# EAGLE schematic module (EAGLE 9.6.2)

## Sheet 1 of 5
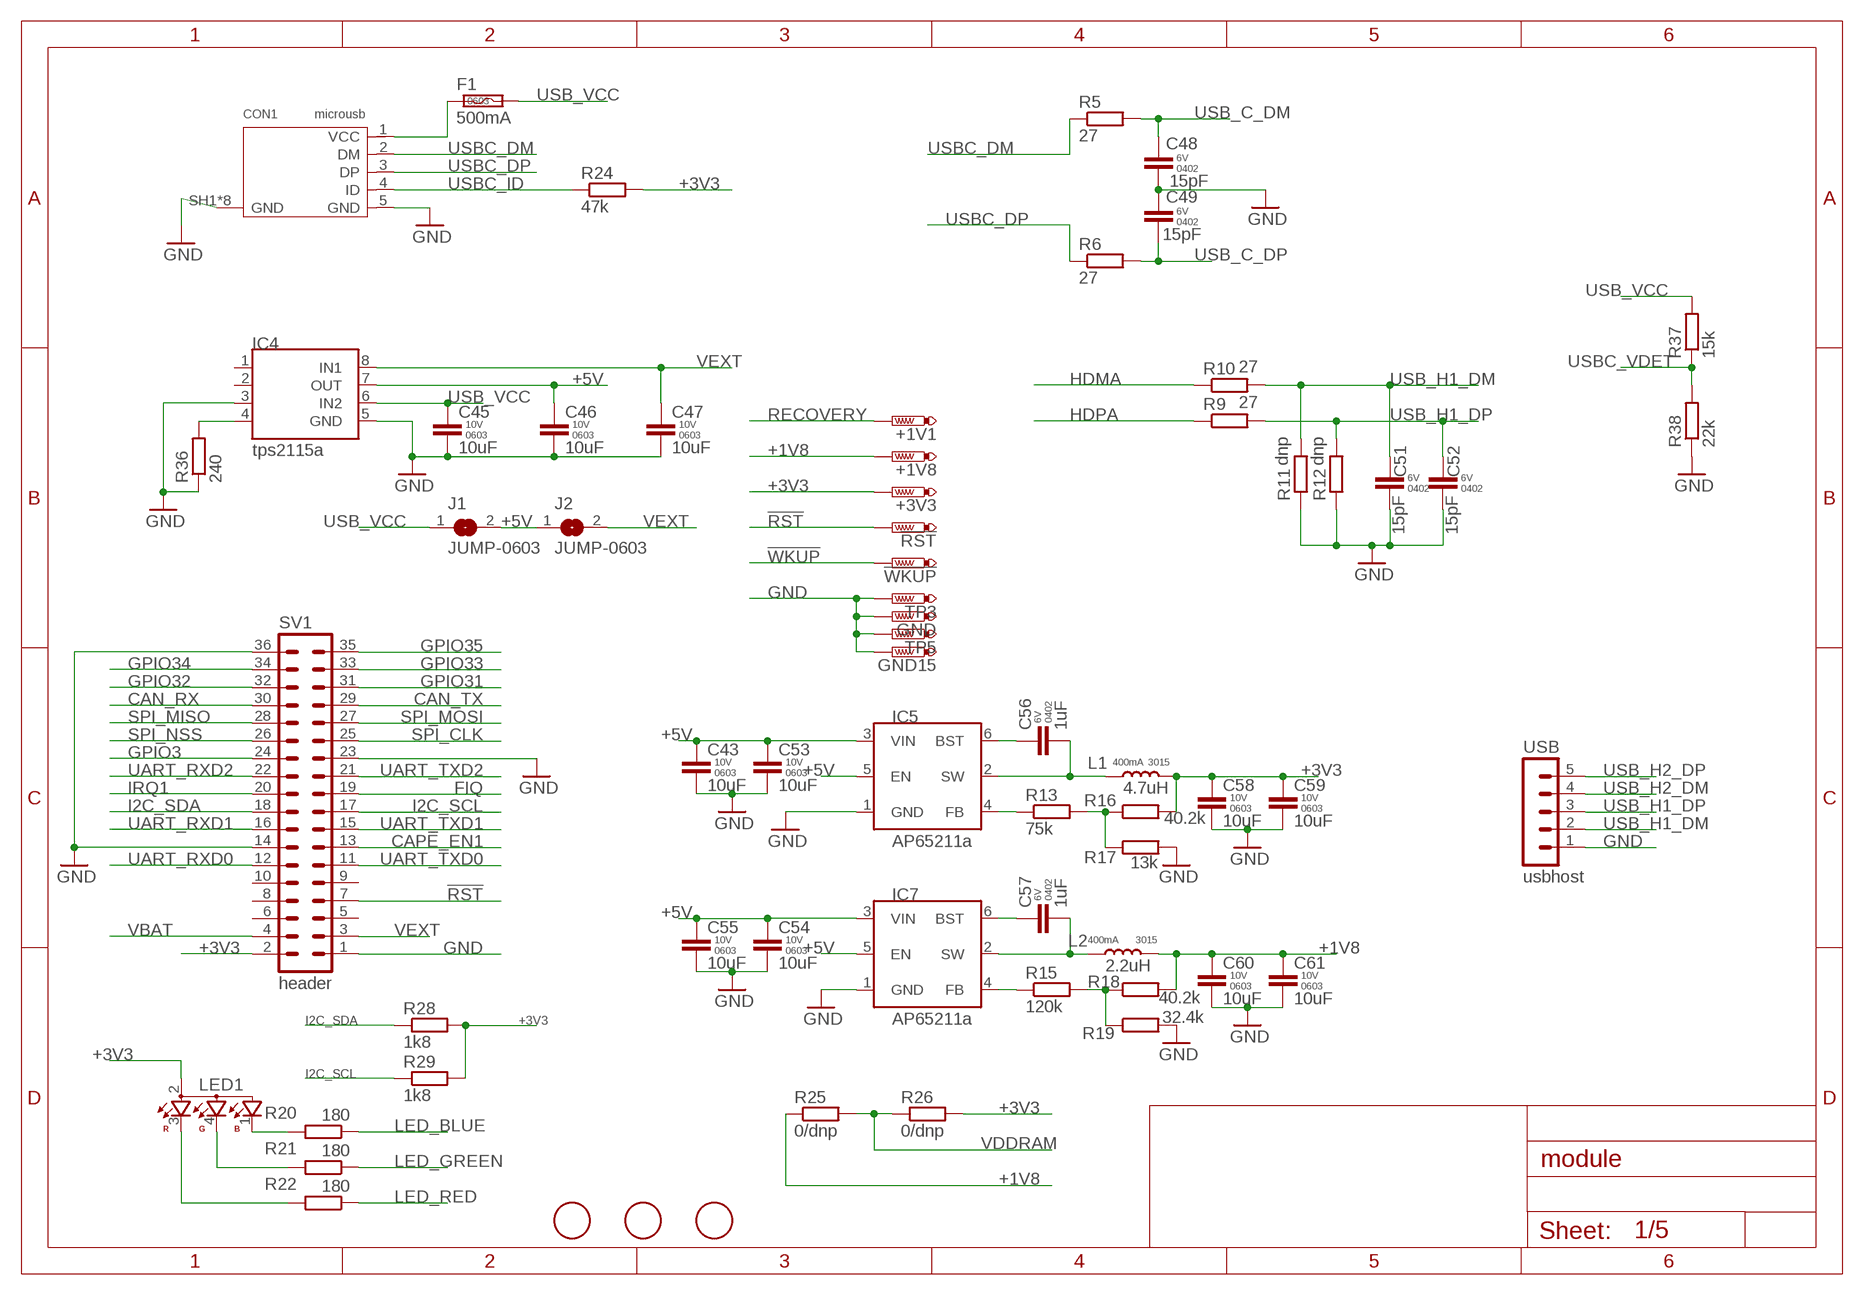
[diagram p0: schematic, sheet 1]

### Parts
!RST  PTR1B1,27  [B1,27]
!WKUP  PTR1B1,27  [B1,27]
+1V1  PTR1B1,27  [B1,27]
+1V8  PTR1B1,27  [B1,27]
+3V3  PTR1B1,27  [B1,27]
C43  10uF  CAP-0603  [C0603]
C45  10uF  CAP-0603  [C0603]
C46  10uF  CAP-0603  [C0603]
C47  10uF  CAP-0603  [C0603]
C48  15pF  CAP-0402  [C0402K]
C49  15pF  CAP-0402  [C0402K]
C51  15pF  CAP-0402  [C0402K]
C52  15pF  CAP-0402  [C0402K]
C53  10uF  CAP-0603  [C0603]
C54  10uF  CAP-0603  [C0603]
C55  10uF  CAP-0603  [C0603]
C56  1uF  CAP-0402  [C0402K]
C57  1uF  CAP-0402  [C0402K]
C58  10uF  CAP-0603  [C0603]
C59  10uF  CAP-0603  [C0603]
C60  10uF  CAP-0603  [C0603]
C61  10uF  CAP-0603  [C0603]
CON1  microusb  10118194-0001LF  [10118194]
F1  500mA  FUSE-PTC-0603  [F0603]
GND  PTR1B1,27  [B1,27]
GND15  PTR1B1,27  [B1,27]
IC4  tps2115a  TPS2115A  [TSSOP8]
IC5  AP65211  [SOT95P280X110-6]
IC7  AP65211  [SOT95P280X110-6]
J1  JUMP-0603  [C0603]
J2  JUMP-0603  [C0603]
L1  4.7uH  DJNR3015  [L3230M]
L2  2.2uH  DJNR3015  [L3230M]
LED1  OSTB1204C1E  [321015RGB]
R5  27  R-EU_R0402  [R0402]
R6  27  R-EU_R0402  [R0402]
R9  27  R-EU_R0402  [R0402]
R10  27  R-EU_R0402  [R0402]
R11  dnp  R-EU_R0402  [R0402]
R12  dnp  R-EU_R0402  [R0402]
R13  75k  R-EU_R0402  [R0402]
R15  120k  R-EU_R0402  [R0402]
R16  40.2k  R-EU_R0402  [R0402]
R17  13k  R-EU_R0402  [R0402]
R18  40.2k  R-EU_R0402  [R0402]
R19  32.4k  R-EU_R0402  [R0402]
R20  180  R-EU_R0402  [R0402]
R21  180  R-EU_R0402  [R0402]
R22  180  R-EU_R0402  [R0402]
R24  47k  R-EU_R0402  [R0402]
R25  0/dnp  R-EU_R0603  [R0603]
R26  0/dnp  R-EU_R0603  [R0603]
R28  1k8  R-EU_R0402  [R0402]
R29  1k8  R-EU_R0402  [R0402]
R36  240  R-EU_R0402  [R0402]
R37  15k  R-EU_R0402  [R0402]
R38  22k  R-EU_R0402  [R0402]
SV1  header  MA18-2  [MA18-2]
TP3  PTR1B1,27  [B1,27]
TP5  PTR1B1,27  [B1,27]
U$1  FIDUCIAL  [FIDUCIAL_1MM]
U$2  FIDUCIAL  [FIDUCIAL_1MM]
U$3  FIDUCIAL  [FIDUCIAL_1MM]
USB  usbhost  MA05-1  [MA05-1]

### Nets
!RST: !RST.TP SV1.7 ; also sheet 2
!WKUP: !WKUP.TP ; also sheet 2
+1V8: +1V8.TP C60.1 C61.1 L2.2 R18.2 R25.1 ; also sheet 2
+3V3: +3V3.TP C58.1 C59.1 L1.2 LED1.2 R16.2 R24.2 R26.2 R28.2 R29.2 SV1.2 ; also sheet 2,5
+5V: C43.1 C46.1 C53.1 C54.1 C55.1 IC4.7(OUT) IC5.3(VIN) IC5.5(EN) IC7.3(VIN) IC7.5(EN) J1.2 J2.1
CAN_RX: SV1.30
CAN_TX: SV1.29
CAPE_EN1: SV1.13 ; also sheet 2
FIQ: SV1.19 ; also sheet 2
GND: C43.2 C45.2 C46.2 C47.2 C48.2 C49.2 C51.2 C52.2 C53.2 C54.2 C55.2 C58.2 C59.2 C60.2 C61.2 CON1.5(GND) CON1.SH1(GND) CON1.SH2(GND) CON1.SH3(GND) CON1.SH4(GND) CON1.SH5(GND) CON1.SH6(GND) CON1.SH7(GND) CON1.SH8(GND) GND15.TP GND.TP IC4.3 IC4.5(GND) IC5.1(GND) IC7.1(GND) R11.1 R12.1 R17.2 R19.2 R36.1 R38.1 SV1.1 SV1.14 SV1.23 SV1.36 TP3.TP TP5.TP USB.1 ; also sheet 2,3,4,5
GPIO3: SV1.24 ; also sheet 2
GPIO31: SV1.31 ; also sheet 2
GPIO32: SV1.32 ; also sheet 2
GPIO33: SV1.33 ; also sheet 2
GPIO34: SV1.34 ; also sheet 2
GPIO35: SV1.35 ; also sheet 2
HDMA: R10.1 ; also sheet 2
HDPA: R9.1 ; also sheet 2
I2C_SCL: R29.1 SV1.17 ; also sheet 2
I2C_SDA: R28.1 SV1.18 ; also sheet 2
IRQ1: SV1.20 ; also sheet 2
LED_BLUE: R20.1 ; also sheet 2
LED_GREEN: R21.1 ; also sheet 2
LED_RED: R22.1 ; also sheet 2
N$3: C56.2 IC5.2(SW) L1.1
N$4: CON1.1(VCC) F1.1
N$6: IC4.4 R36.2
N$8: C57.2 IC7.2(SW) L2.1
N$9: LED1.1 R20.2
N$10: C56.1 IC5.6(BST)
N$11: C57.1 IC7.6(BST)
N$14: LED1.4 R21.2
N$15: IC7.4(FB) R15.1
N$20: IC5.4(FB) R13.1
N$21: R15.2 R18.1 R19.1
N$22: R13.2 R16.1 R17.1
N$23: LED1.3 R22.2
RECOVERY: +1V1.TP ; also sheet 2
SPI_CLK: SV1.25 ; also sheet 2
SPI_MISO: SV1.28 ; also sheet 2
SPI_MOSI: SV1.27 ; also sheet 2
SPI_NSS: SV1.26 ; also sheet 2
UART_RXD0: SV1.12 ; also sheet 2
UART_RXD1: SV1.16 ; also sheet 2
UART_RXD2: SV1.22 ; also sheet 2
UART_TXD0: SV1.11 ; also sheet 2
UART_TXD1: SV1.15 ; also sheet 2
UART_TXD2: SV1.21 ; also sheet 2
USB_C_DM: C48.1 R5.2 ; also sheet 2
USB_C_DP: C49.1 R6.2 ; also sheet 2
USB_H1_DM: C51.1 R10.2 R11.2 USB.2
USB_H1_DP: C52.1 R9.2 R12.2 USB.3
USB_H2_DM: USB.4
USB_H2_DP: USB.5
USB_VCC: C45.1 F1.2 IC4.6(IN2) J1.1 R37.2
USBC_DM: CON1.2(DM) R5.1
USBC_DP: CON1.3(DP) R6.1
USBC_ID: CON1.4(ID) R24.1 ; also sheet 2
USBC_VDET: R37.1 R38.2 ; also sheet 2
VBAT: SV1.4
VDDRAM: R25.2 R26.1 ; also sheet 2,3
VEXT: C47.1 IC4.8(IN1) J2.2 SV1.3
Unconnected: IC4.1 IC4.2 SV1.5 SV1.6 SV1.8 SV1.9 SV1.10

## Sheet 2 of 5
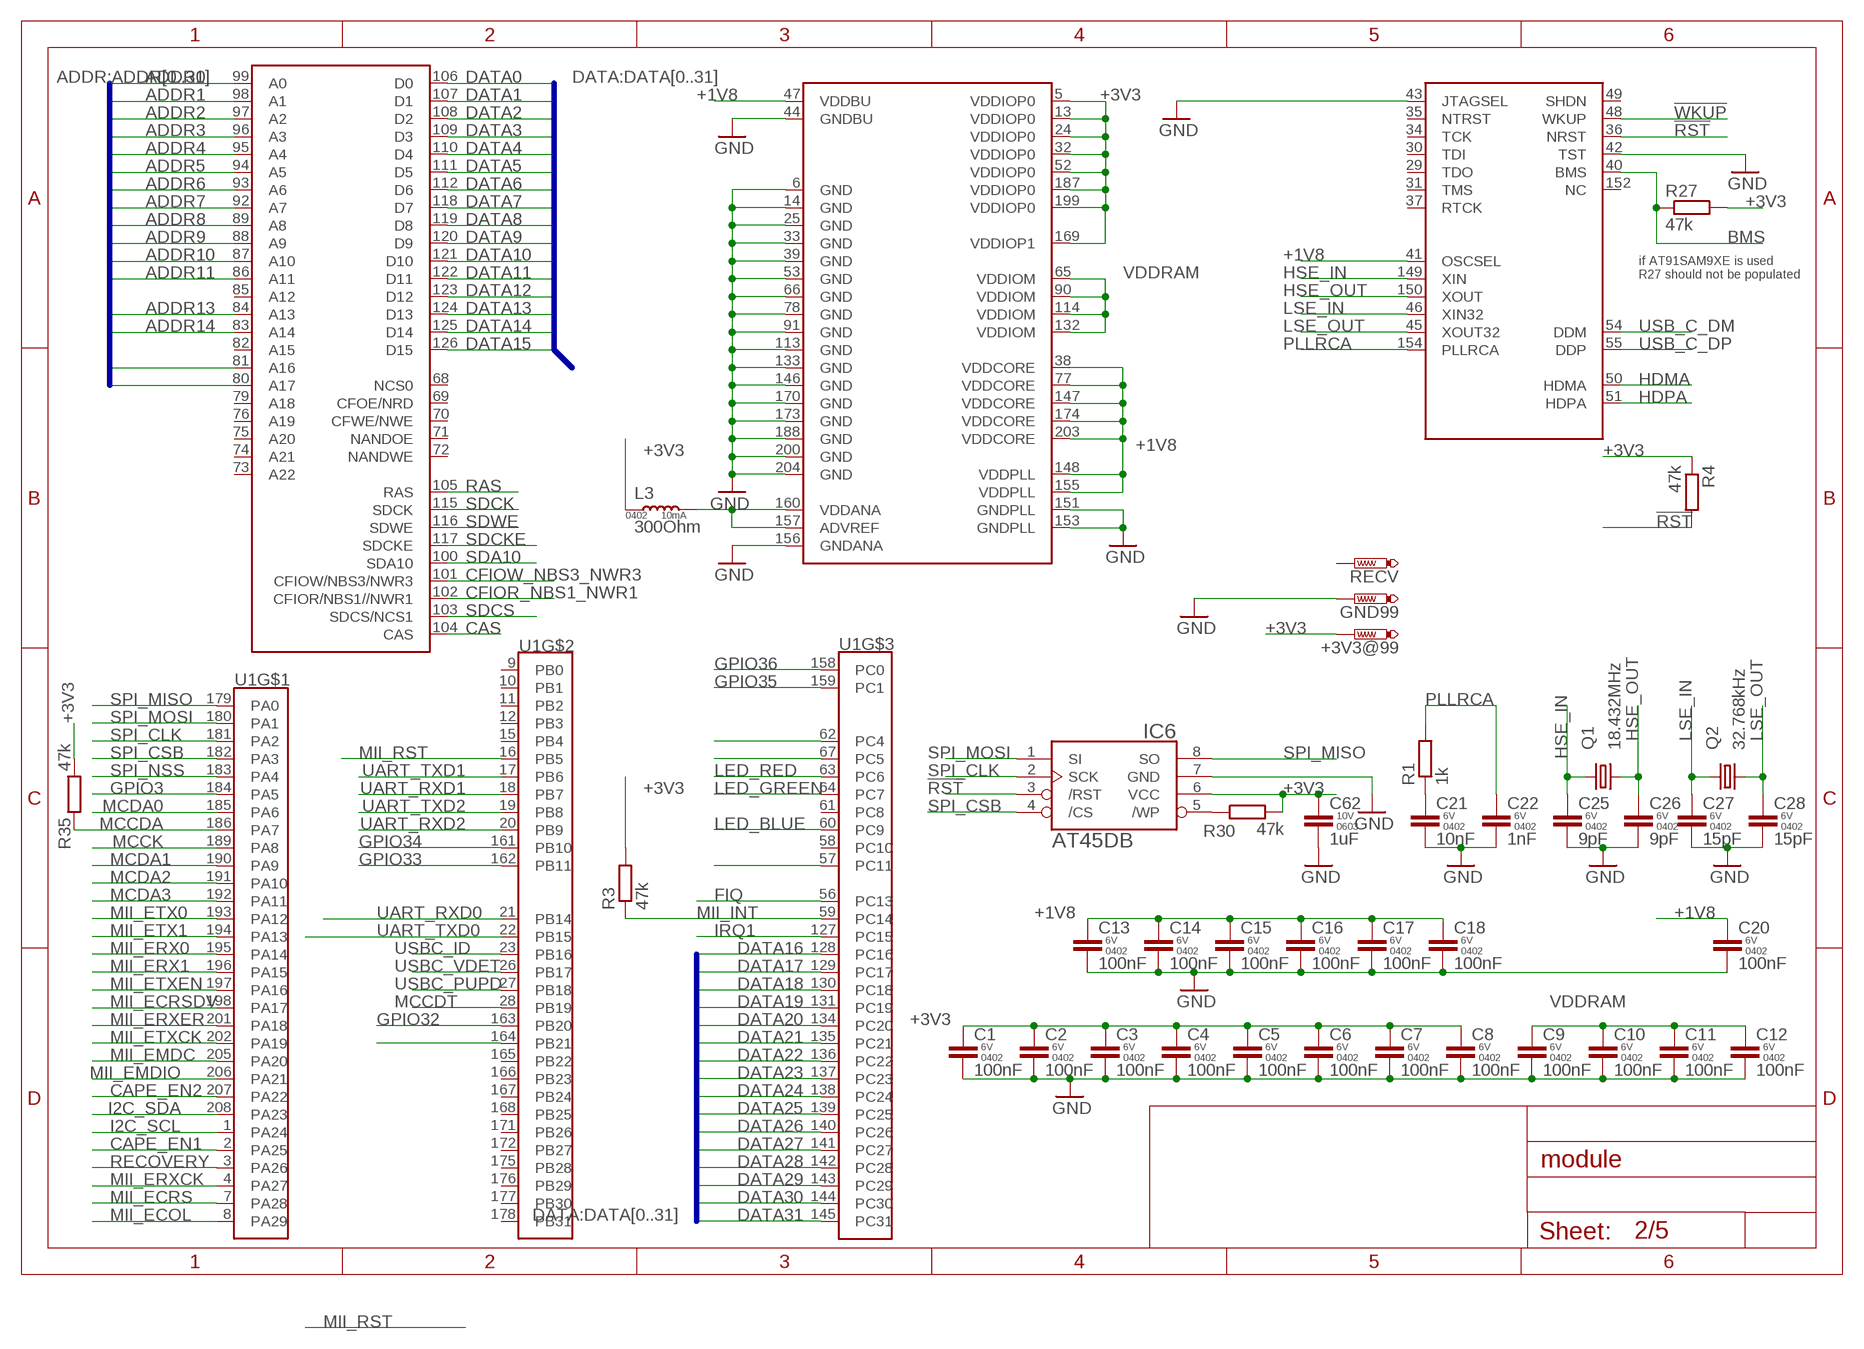
[diagram p1: schematic, sheet 2]

### Parts
+3V3@99  PTR1B1,27  [B1,27]
C1  100nF  CAP-0402  [C0402K]
C2  100nF  CAP-0402  [C0402K]
C3  100nF  CAP-0402  [C0402K]
C4  100nF  CAP-0402  [C0402K]
C5  100nF  CAP-0402  [C0402K]
C6  100nF  CAP-0402  [C0402K]
C7  100nF  CAP-0402  [C0402K]
C8  100nF  CAP-0402  [C0402K]
C9  100nF  CAP-0402  [C0402K]
C10  100nF  CAP-0402  [C0402K]
C11  100nF  CAP-0402  [C0402K]
C12  100nF  CAP-0402  [C0402K]
C13  100nF  CAP-0402  [C0402K]
C14  100nF  CAP-0402  [C0402K]
C15  100nF  CAP-0402  [C0402K]
C16  100nF  CAP-0402  [C0402K]
C17  100nF  CAP-0402  [C0402K]
C18  100nF  CAP-0402  [C0402K]
C20  100nF  CAP-0402  [C0402K]
C21  10nF  CAP-0402  [C0402K]
C22  1nF  CAP-0402  [C0402K]
C25  9pF  CAP-0402  [C0402K]
C26  9pF  CAP-0402  [C0402K]
C27  15pF  CAP-0402  [C0402K]
C28  15pF  CAP-0402  [C0402K]
C62  1uF  CAP-0603  [C0603]
GND99  PTR1B1,27  [B1,27]
IC6  AT45DB-S  [SO08-208]
L3  300Ohm  IND-0402  [L0402]
Q1  18.432MHz  3215-7  [3215]
Q2  32.768kHz  CFPX–217-NHT  [3215]
R1  1k  R-EU_R0402  [R0402]
R3  47k  R-EU_R0402  [R0402]
R4  47k  R-EU_R0402  [R0402]
R27  47k  R-EU_R0402  [R0402]
R30  47k  R-EU_R0402  [R0402]
R35  47k  R-EU_R0402  [R0402]
RECV  PTR1B1,27  [B1,27]
U1  AT91SAM9260-  [QFP50P3120X3120X410-208N]

### Nets
!RST: IC6.3(/RST) R4.2 U1.36(NRST) ; also sheet 1
!WKUP: U1.48(WKUP) ; also sheet 1
+1V8: C13.1 C14.1 C15.1 C16.1 C17.1 C18.1 C20.1 U1.38(VDDCORE) U1.41(OSCSEL) U1.47(VDDBU) U1.77(VDDCORE) U1.147(VDDCORE) U1.148(VDDPLL) U1.155(VDDPLL) U1.174(VDDCORE) U1.203(VDDCORE) ; also sheet 1
+3V3: +3V3@99.TP C1.1 C2.1 C3.1 C4.1 C5.1 C6.1 C7.1 C8.1 C62.1 IC6.6(VCC) L3.1 R3.2 R4.1 R27.2 R30.2 R35.2 U1.5(VDDIOP0) U1.13(VDDIOP0) U1.24(VDDIOP0) U1.32(VDDIOP0) U1.52(VDDIOP0) U1.169(VDDIOP1) U1.187(VDDIOP0) U1.199(VDDIOP0) ; also sheet 1,5
ADDR0: U1.99(A0) ; also sheet 3
ADDR1: U1.98(A1) ; also sheet 3
ADDR2: U1.97(A2) ; also sheet 3
ADDR3: U1.96(A3) ; also sheet 3
ADDR4: U1.95(A4) ; also sheet 3
ADDR5: U1.94(A5) ; also sheet 3
ADDR6: U1.93(A6) ; also sheet 3
ADDR7: U1.92(A7) ; also sheet 3
ADDR8: U1.89(A8) ; also sheet 3
ADDR9: U1.88(A9) ; also sheet 3
ADDR10: U1.87(A10) ; also sheet 3
ADDR11: U1.86(A11) ; also sheet 3
ADDR13: U1.84(A13) ; also sheet 3
ADDR14: U1.83(A14) ; also sheet 3
ADDR16: U1.81(A16) ; also sheet 3
ADDR17: U1.80(A17) ; also sheet 3
BMS: R27.1 U1.40(BMS)
CAPE_EN1: U1.2(PA25) ; also sheet 1
CAPE_EN2: U1.207(PA22)
CAS: U1.104(CAS) ; also sheet 3
CFIOR_NBS1_NWR1: U1.102(CFIOR/NBS1//NWR1) ; also sheet 3
CFIOW_NBS3_NWR3: U1.101(CFIOW/NBS3/NWR3) ; also sheet 3
DATA0: U1.106(D0) ; also sheet 3
DATA1: U1.107(D1) ; also sheet 3
DATA2: U1.108(D2) ; also sheet 3
DATA3: U1.109(D3) ; also sheet 3
DATA4: U1.110(D4) ; also sheet 3
DATA5: U1.111(D5) ; also sheet 3
DATA6: U1.112(D6) ; also sheet 3
DATA7: U1.118(D7) ; also sheet 3
DATA8: U1.119(D8) ; also sheet 3
DATA9: U1.120(D9) ; also sheet 3
DATA10: U1.121(D10) ; also sheet 3
DATA11: U1.122(D11) ; also sheet 3
DATA12: U1.123(D12) ; also sheet 3
DATA13: U1.124(D13) ; also sheet 3
DATA14: U1.125(D14) ; also sheet 3
DATA15: U1.126(D15) ; also sheet 3
DATA16: U1.128(PC16) ; also sheet 3
DATA17: U1.129(PC17) ; also sheet 3
DATA18: U1.130(PC18) ; also sheet 3
DATA19: U1.131(PC19) ; also sheet 3
DATA20: U1.134(PC20) ; also sheet 3
DATA21: U1.135(PC21) ; also sheet 3
DATA22: U1.136(PC22) ; also sheet 3
DATA23: U1.137(PC23) ; also sheet 3
DATA24: U1.138(PC24) ; also sheet 3
DATA25: U1.139(PC25) ; also sheet 3
DATA26: U1.140(PC26) ; also sheet 3
DATA27: U1.141(PC27) ; also sheet 3
DATA28: U1.142(PC28) ; also sheet 3
DATA29: U1.143(PC29) ; also sheet 3
DATA30: U1.144(PC30) ; also sheet 3
DATA31: U1.145(PC31) ; also sheet 3
FIQ: U1.56(PC13) ; also sheet 1
GND: C1.2 C2.2 C3.2 C4.2 C5.2 C6.2 C7.2 C8.2 C9.2 C10.2 C11.2 C12.2 C13.2 C14.2 C15.2 C16.2 C17.2 C18.2 C20.2 C21.2 C22.2 C25.2 C26.2 C27.2 C28.2 C62.2 GND99.TP IC6.7(GND) U1.6(GND) U1.14(GND) U1.25(GND) U1.33(GND) U1.39(GND) U1.42(TST) U1.43(JTAGSEL) U1.44(GNDBU) U1.53(GND) U1.66(GND) U1.78(GND) U1.91(GND) U1.113(GND) U1.133(GND) U1.146(GND) U1.151(GNDPLL) U1.153(GNDPLL) U1.156(GNDANA) U1.170(GND) U1.173(GND) U1.188(GND) U1.200(GND) U1.204(GND) ; also sheet 1,3,4,5
GPIO3: U1.184(PA5) ; also sheet 1
GPIO31: U1.164(PB21) ; also sheet 1
GPIO32: U1.163(PB20) ; also sheet 1
GPIO33: U1.162(PB11) ; also sheet 1
GPIO34: U1.161(PB10) ; also sheet 1
GPIO35: U1.159(PC1) ; also sheet 1
GPIO36: U1.158(PC0)
HDMA: U1.50(HDMA) ; also sheet 1
HDPA: U1.51(HDPA) ; also sheet 1
HSE_IN: C25.1 Q1.1 U1.149(XIN)
HSE_OUT: C26.1 Q1.3 U1.150(XOUT)
I2C_SCL: U1.1(PA24) ; also sheet 1
I2C_SDA: U1.208(PA23) ; also sheet 1
IRQ1: U1.127(PC15) ; also sheet 1
LED_BLUE: U1.60(PC9) ; also sheet 1
LED_GREEN: U1.64(PC7) ; also sheet 1
LED_RED: U1.63(PC6) ; also sheet 1
LSE_IN: C27.1 Q2.1 U1.46(XIN32)
LSE_OUT: C28.1 Q2.2 U1.45(XOUT32)
MCCDA: R35.1 U1.186(PA7) ; also sheet 5
MCCDT: U1.28(PB19) ; also sheet 5
MCCK: U1.189(PA8) ; also sheet 5
MCDA0: U1.185(PA6) ; also sheet 5
MCDA1: U1.190(PA9) ; also sheet 5
MCDA2: U1.191(PA10) ; also sheet 5
MCDA3: U1.192(PA11) ; also sheet 5
MII_ECOL: U1.8(PA29)
MII_ECRS: U1.7(PA28)
MII_ECRSDV: U1.198(PA17) ; also sheet 4
MII_EMDC: U1.205(PA20) ; also sheet 4
MII_EMDIO: U1.206(PA21) ; also sheet 4
MII_ERX0: U1.195(PA14) ; also sheet 4
MII_ERX1: U1.196(PA15) ; also sheet 4
MII_ERXCK: U1.4(PA27)
MII_ERXER: U1.201(PA18) ; also sheet 4
MII_ETX0: U1.193(PA12) ; also sheet 4
MII_ETX1: U1.194(PA13) ; also sheet 4
MII_ETXCK: U1.202(PA19) ; also sheet 4
MII_ETXEN: U1.197(PA16) ; also sheet 4
MII_INT: R3.1 U1.59(PC14) ; also sheet 4
MII_RST: U1.16(PB5) ; also sheet 4
N$1: C21.1 R1.1
N$2: IC6.5(/WP) R30.1
N$12: U1.57(PC11)
N$13: U1.67(PC5)
N$16: U1.62(PC4)
N$28: L3.2 U1.157(ADVREF) U1.160(VDDANA)
PLLRCA: C22.1 R1.2 U1.154(PLLRCA)
RAS: U1.105(RAS) ; also sheet 3
RECOVERY: U1.3(PA26) ; also sheet 1
SDA10: U1.100(SDA10) ; also sheet 3
SDCK: U1.115(SDCK) ; also sheet 3
SDCKE: U1.117(SDCKE) ; also sheet 3
SDCS: U1.103(SDCS/NCS1) ; also sheet 3
SDWE: U1.116(SDWE) ; also sheet 3
SPI_CLK: IC6.2(SCK) U1.181(PA2) ; also sheet 1
SPI_CSB: IC6.4(/CS) U1.182(PA3)
SPI_MISO: IC6.8(SO) U1.179(PA0) ; also sheet 1
SPI_MOSI: IC6.1(SI) U1.180(PA1) ; also sheet 1
SPI_NSS: U1.183(PA4) ; also sheet 1
UART_RXD0: U1.21(PB14) ; also sheet 1
UART_RXD1: U1.18(PB7) ; also sheet 1
UART_RXD2: U1.20(PB9) ; also sheet 1
UART_TXD0: U1.22(PB15) ; also sheet 1
UART_TXD1: U1.17(PB6) ; also sheet 1
UART_TXD2: U1.19(PB8) ; also sheet 1
USB_C_DM: U1.54(DDM) ; also sheet 1
USB_C_DP: U1.55(DDP) ; also sheet 1
USBC_ID: U1.23(PB16) ; also sheet 1
USBC_PUPD: U1.27(PB18)
USBC_VDET: U1.26(PB17) ; also sheet 1
VDDRAM: C9.1 C10.1 C11.1 C12.1 U1.65(VDDIOM) U1.90(VDDIOM) U1.114(VDDIOM) U1.132(VDDIOM) ; also sheet 1,3
Unconnected: RECV.TP U1.9(PB0) U1.10(PB1) U1.11(PB2) U1.12(PB3) U1.15(PB4) U1.29(TDO) U1.30(TDI) U1.31(TMS) U1.34(TCK) U1.35(NTRST) U1.37(RTCK) U1.49(SHDN) U1.58(PC10) U1.61(PC8) U1.68(NCS0) U1.69(CFOE/NRD) U1.70(CFWE/NWE) U1.71(NANDOE) U1.72(NANDWE) U1.73(A22) U1.74(A21) U1.75(A20) U1.76(A19) U1.79(A18) U1.82(A15) U1.85(A12) U1.152(NC) U1.165(PB22) U1.166(PB23) U1.167(PB24) U1.168(PB25) U1.171(PB26) U1.172(PB27) U1.175(PB28) U1.176(PB29) U1.177(PB30) U1.178(PB31)

### Buses
ADDR:ADDR[0..31]
DATA:DATA[0..31]

### Notes on the sheet
- if AT91SAM9XE is used 
  R27 should not be populated

## Sheet 3 of 5: SDRAM
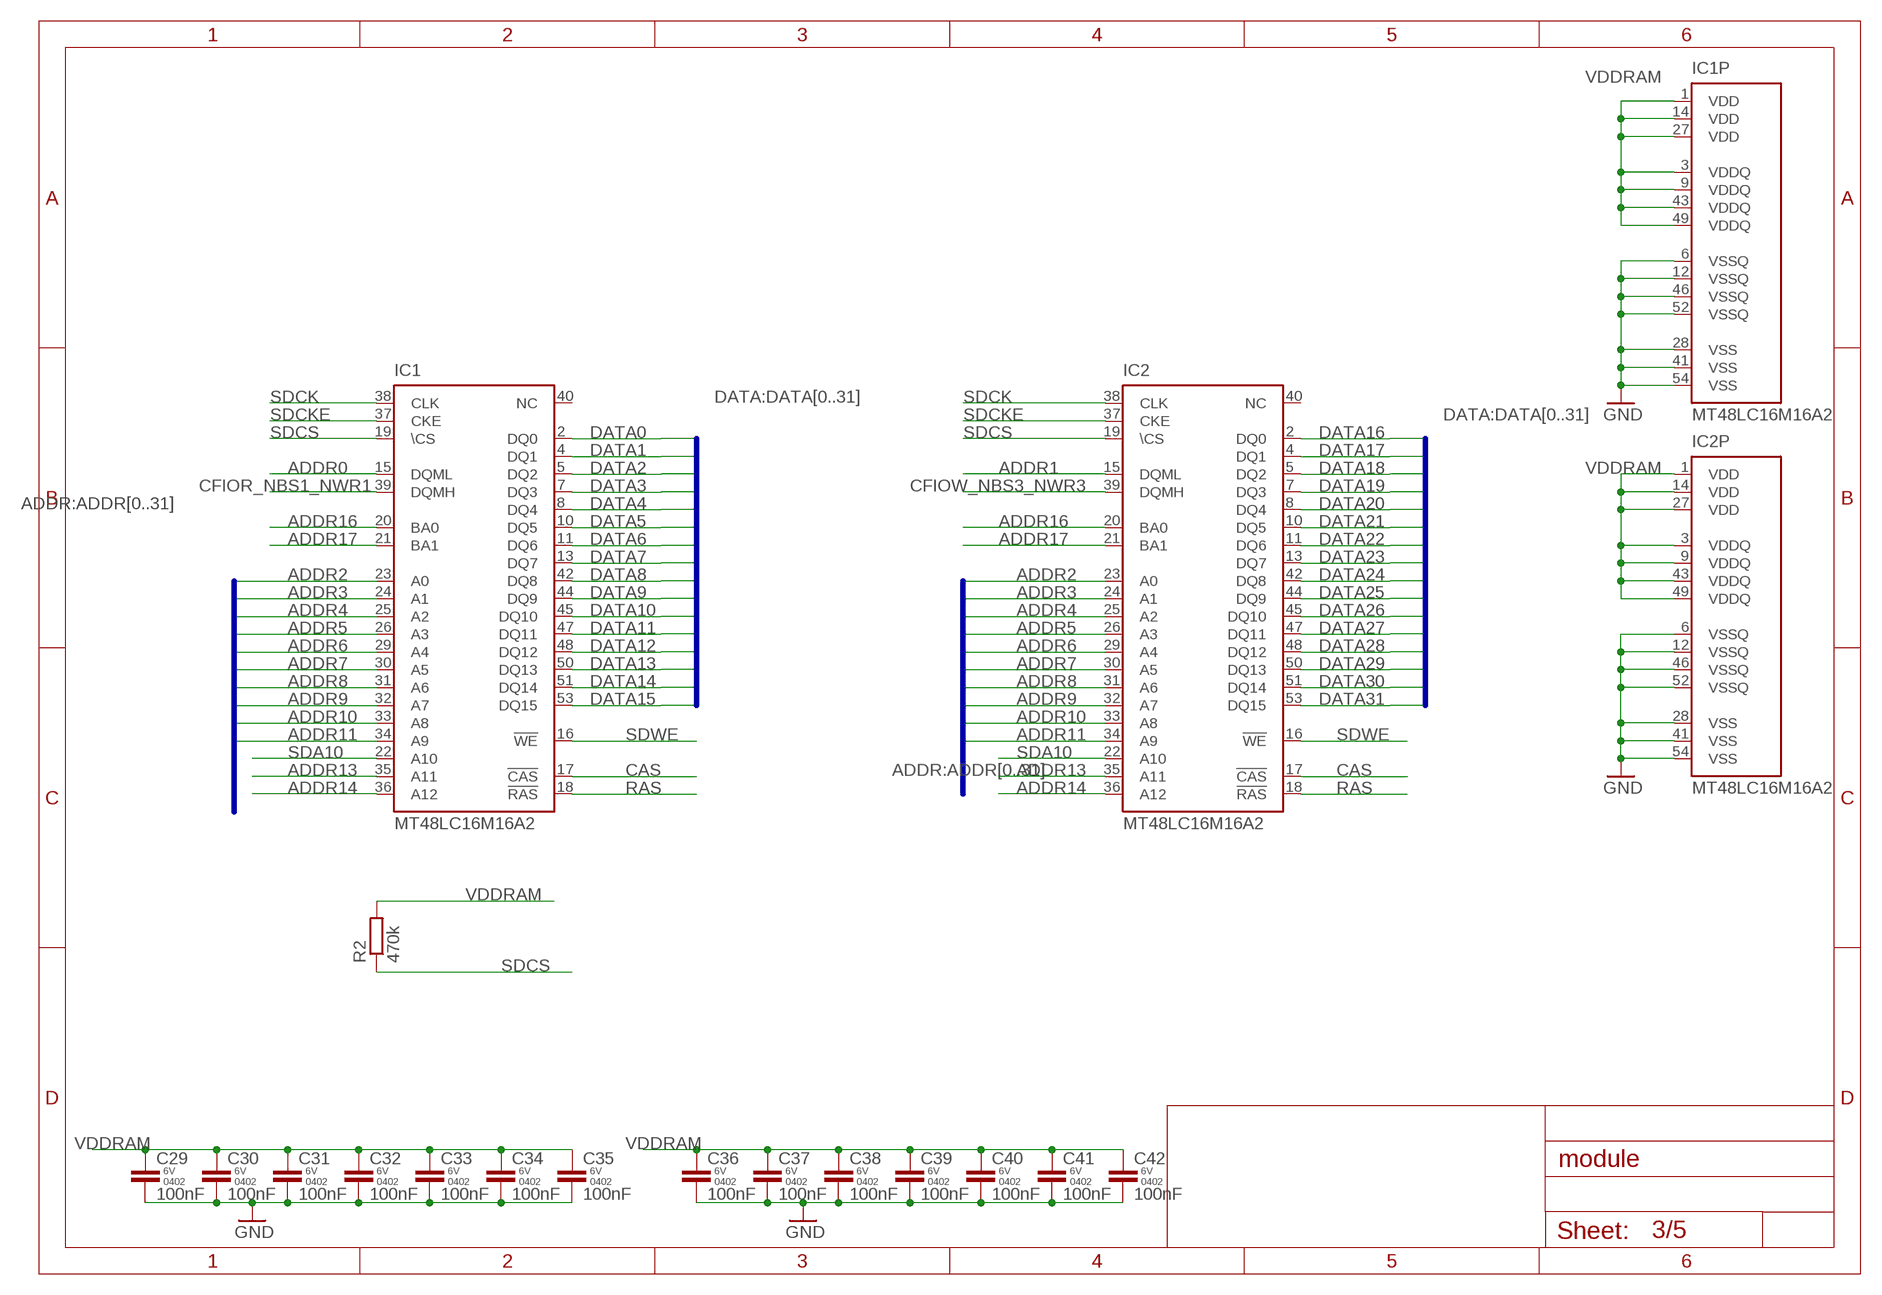
[diagram p2: schematic, sheet 3]

### Parts
C29  100nF  CAP-0402  [C0402K]
C30  100nF  CAP-0402  [C0402K]
C31  100nF  CAP-0402  [C0402K]
C32  100nF  CAP-0402  [C0402K]
C33  100nF  CAP-0402  [C0402K]
C34  100nF  CAP-0402  [C0402K]
C35  100nF  CAP-0402  [C0402K]
C36  100nF  CAP-0402  [C0402K]
C37  100nF  CAP-0402  [C0402K]
C38  100nF  CAP-0402  [C0402K]
C39  100nF  CAP-0402  [C0402K]
C40  100nF  CAP-0402  [C0402K]
C41  100nF  CAP-0402  [C0402K]
C42  100nF  CAP-0402  [C0402K]
IC1  MT48LC16M16A2  [TSOP54-400]
IC2  MT48LC16M16A2  [TSOP54-400]
R2  470k  R-EU_R0402  [R0402]

### Nets
ADDR0: IC1.15(DQML) ; also sheet 2
ADDR1: IC2.15(DQML) ; also sheet 2
ADDR2: IC1.23(A0) IC2.23(A0) ; also sheet 2
ADDR3: IC1.24(A1) IC2.24(A1) ; also sheet 2
ADDR4: IC1.25(A2) IC2.25(A2) ; also sheet 2
ADDR5: IC1.26(A3) IC2.26(A3) ; also sheet 2
ADDR6: IC1.29(A4) IC2.29(A4) ; also sheet 2
ADDR7: IC1.30(A5) IC2.30(A5) ; also sheet 2
ADDR8: IC1.31(A6) IC2.31(A6) ; also sheet 2
ADDR9: IC1.32(A7) IC2.32(A7) ; also sheet 2
ADDR10: IC1.33(A8) IC2.33(A8) ; also sheet 2
ADDR11: IC1.34(A9) IC2.34(A9) ; also sheet 2
ADDR13: IC1.35(A11) IC2.35(A11) ; also sheet 2
ADDR14: IC1.36(A12) IC2.36(A12) ; also sheet 2
ADDR16: IC1.20(BA0) IC2.20(BA0) ; also sheet 2
ADDR17: IC1.21(BA1) IC2.21(BA1) ; also sheet 2
CAS: IC1.17(!CAS) IC2.17(!CAS) ; also sheet 2
CFIOR_NBS1_NWR1: IC1.39(DQMH) ; also sheet 2
CFIOW_NBS3_NWR3: IC2.39(DQMH) ; also sheet 2
DATA0: IC1.2(DQ0) ; also sheet 2
DATA1: IC1.4(DQ1) ; also sheet 2
DATA2: IC1.5(DQ2) ; also sheet 2
DATA3: IC1.7(DQ3) ; also sheet 2
DATA4: IC1.8(DQ4) ; also sheet 2
DATA5: IC1.10(DQ5) ; also sheet 2
DATA6: IC1.11(DQ6) ; also sheet 2
DATA7: IC1.13(DQ7) ; also sheet 2
DATA8: IC1.42(DQ8) ; also sheet 2
DATA9: IC1.44(DQ9) ; also sheet 2
DATA10: IC1.45(DQ10) ; also sheet 2
DATA11: IC1.47(DQ11) ; also sheet 2
DATA12: IC1.48(DQ12) ; also sheet 2
DATA13: IC1.50(DQ13) ; also sheet 2
DATA14: IC1.51(DQ14) ; also sheet 2
DATA15: IC1.53(DQ15) ; also sheet 2
DATA16: IC2.2(DQ0) ; also sheet 2
DATA17: IC2.4(DQ1) ; also sheet 2
DATA18: IC2.5(DQ2) ; also sheet 2
DATA19: IC2.7(DQ3) ; also sheet 2
DATA20: IC2.8(DQ4) ; also sheet 2
DATA21: IC2.10(DQ5) ; also sheet 2
DATA22: IC2.11(DQ6) ; also sheet 2
DATA23: IC2.13(DQ7) ; also sheet 2
DATA24: IC2.42(DQ8) ; also sheet 2
DATA25: IC2.44(DQ9) ; also sheet 2
DATA26: IC2.45(DQ10) ; also sheet 2
DATA27: IC2.47(DQ11) ; also sheet 2
DATA28: IC2.48(DQ12) ; also sheet 2
DATA29: IC2.50(DQ13) ; also sheet 2
DATA30: IC2.51(DQ14) ; also sheet 2
DATA31: IC2.53(DQ15) ; also sheet 2
GND: C29.2 C30.2 C31.2 C32.2 C33.2 C34.2 C35.2 C36.2 C37.2 C38.2 C39.2 C40.2 C41.2 C42.2 IC1.6(VSSQ) IC1.12(VSSQ) IC1.28(VSS) IC1.41(VSS) IC1.46(VSSQ) IC1.52(VSSQ) IC1.54(VSS) IC2.6(VSSQ) IC2.12(VSSQ) IC2.28(VSS) IC2.41(VSS) IC2.46(VSSQ) IC2.52(VSSQ) IC2.54(VSS) ; also sheet 1,2,4,5
RAS: IC1.18(!RAS) IC2.18(!RAS) ; also sheet 2
SDA10: IC1.22(A10) IC2.22(A10) ; also sheet 2
SDCK: IC1.38(CLK) IC2.38(CLK) ; also sheet 2
SDCKE: IC1.37(CKE) IC2.37(CKE) ; also sheet 2
SDCS: IC1.19(\CS) IC2.19(\CS) R2.1 ; also sheet 2
SDWE: IC1.16(!WE) IC2.16(!WE) ; also sheet 2
VDDRAM: C29.1 C30.1 C31.1 C32.1 C33.1 C34.1 C35.1 C36.1 C37.1 C38.1 C39.1 C40.1 C41.1 C42.1 IC1.1(VDD) IC1.3(VDDQ) IC1.9(VDDQ) IC1.14(VDD) IC1.27(VDD) IC1.43(VDDQ) IC1.49(VDDQ) IC2.1(VDD) IC2.3(VDDQ) IC2.9(VDDQ) IC2.14(VDD) IC2.27(VDD) IC2.43(VDDQ) IC2.49(VDDQ) R2.2 ; also sheet 1,2
Unconnected: IC1.40(NC) IC2.40(NC)

### Buses
DATA:DATA[0..31]
ADDR:ADDR[0..31]

## Sheet 4 of 5: Ethernet
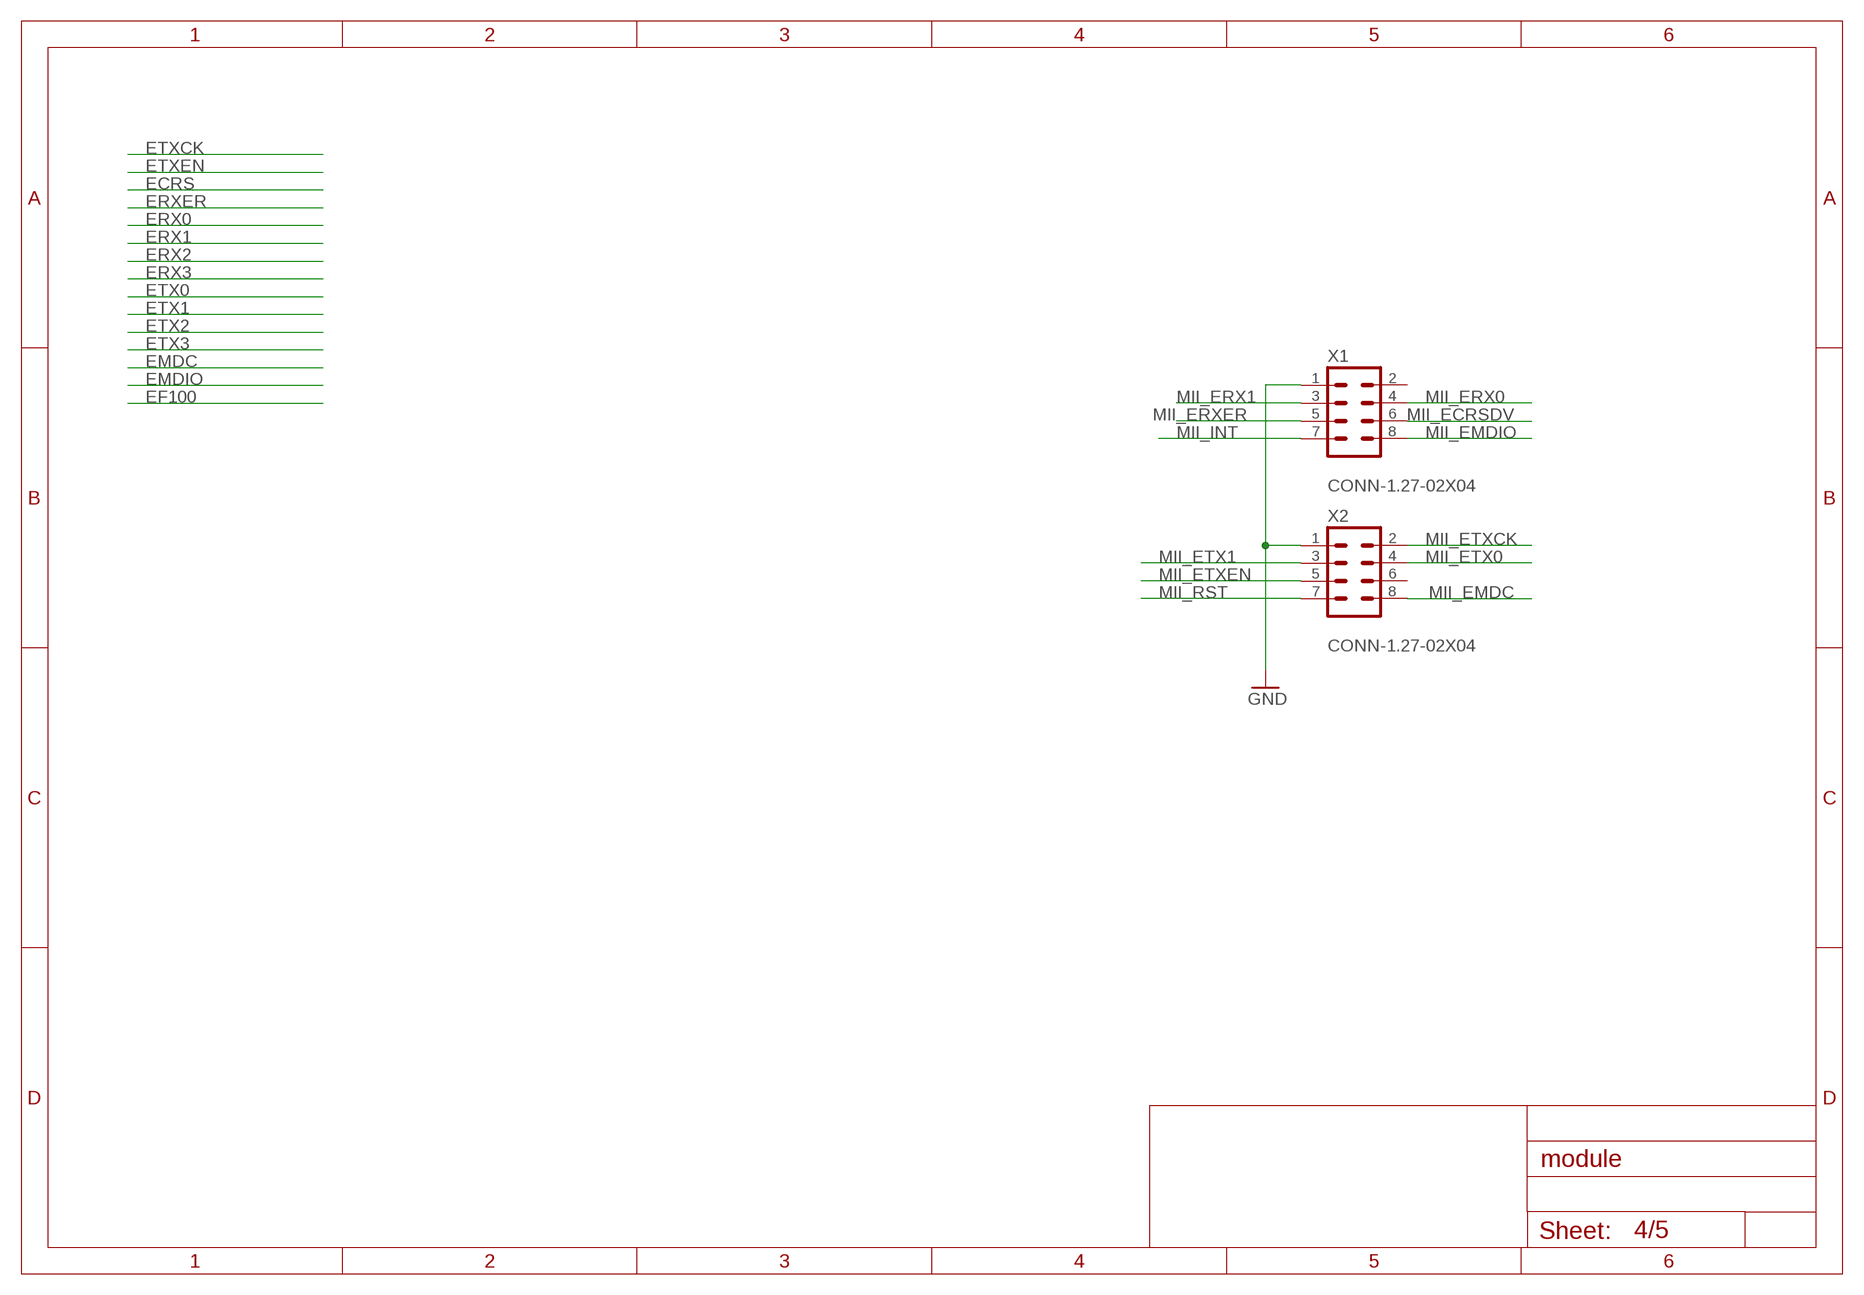
[diagram p3: schematic, sheet 4]

### Parts
X1  CONN-1.27-02X04  [050_610_HN-5/10]
X2  CONN-1.27-02X04  [050_610_HN-5/10]

### Nets
GND: X1.1 X2.1 ; also sheet 1,2,3,5
MII_ECRSDV: X1.6 ; also sheet 2
MII_EMDC: X2.8 ; also sheet 2
MII_EMDIO: X1.8 ; also sheet 2
MII_ERX0: X1.4 ; also sheet 2
MII_ERX1: X1.3 ; also sheet 2
MII_ERXER: X1.5 ; also sheet 2
MII_ETX0: X2.4 ; also sheet 2
MII_ETX1: X2.3 ; also sheet 2
MII_ETXCK: X2.2 ; also sheet 2
MII_ETXEN: X2.5 ; also sheet 2
MII_INT: X1.7 ; also sheet 2
MII_RST: X2.7 ; also sheet 2
Unconnected: X1.2 X2.6

## Sheet 5 of 5: SD Card
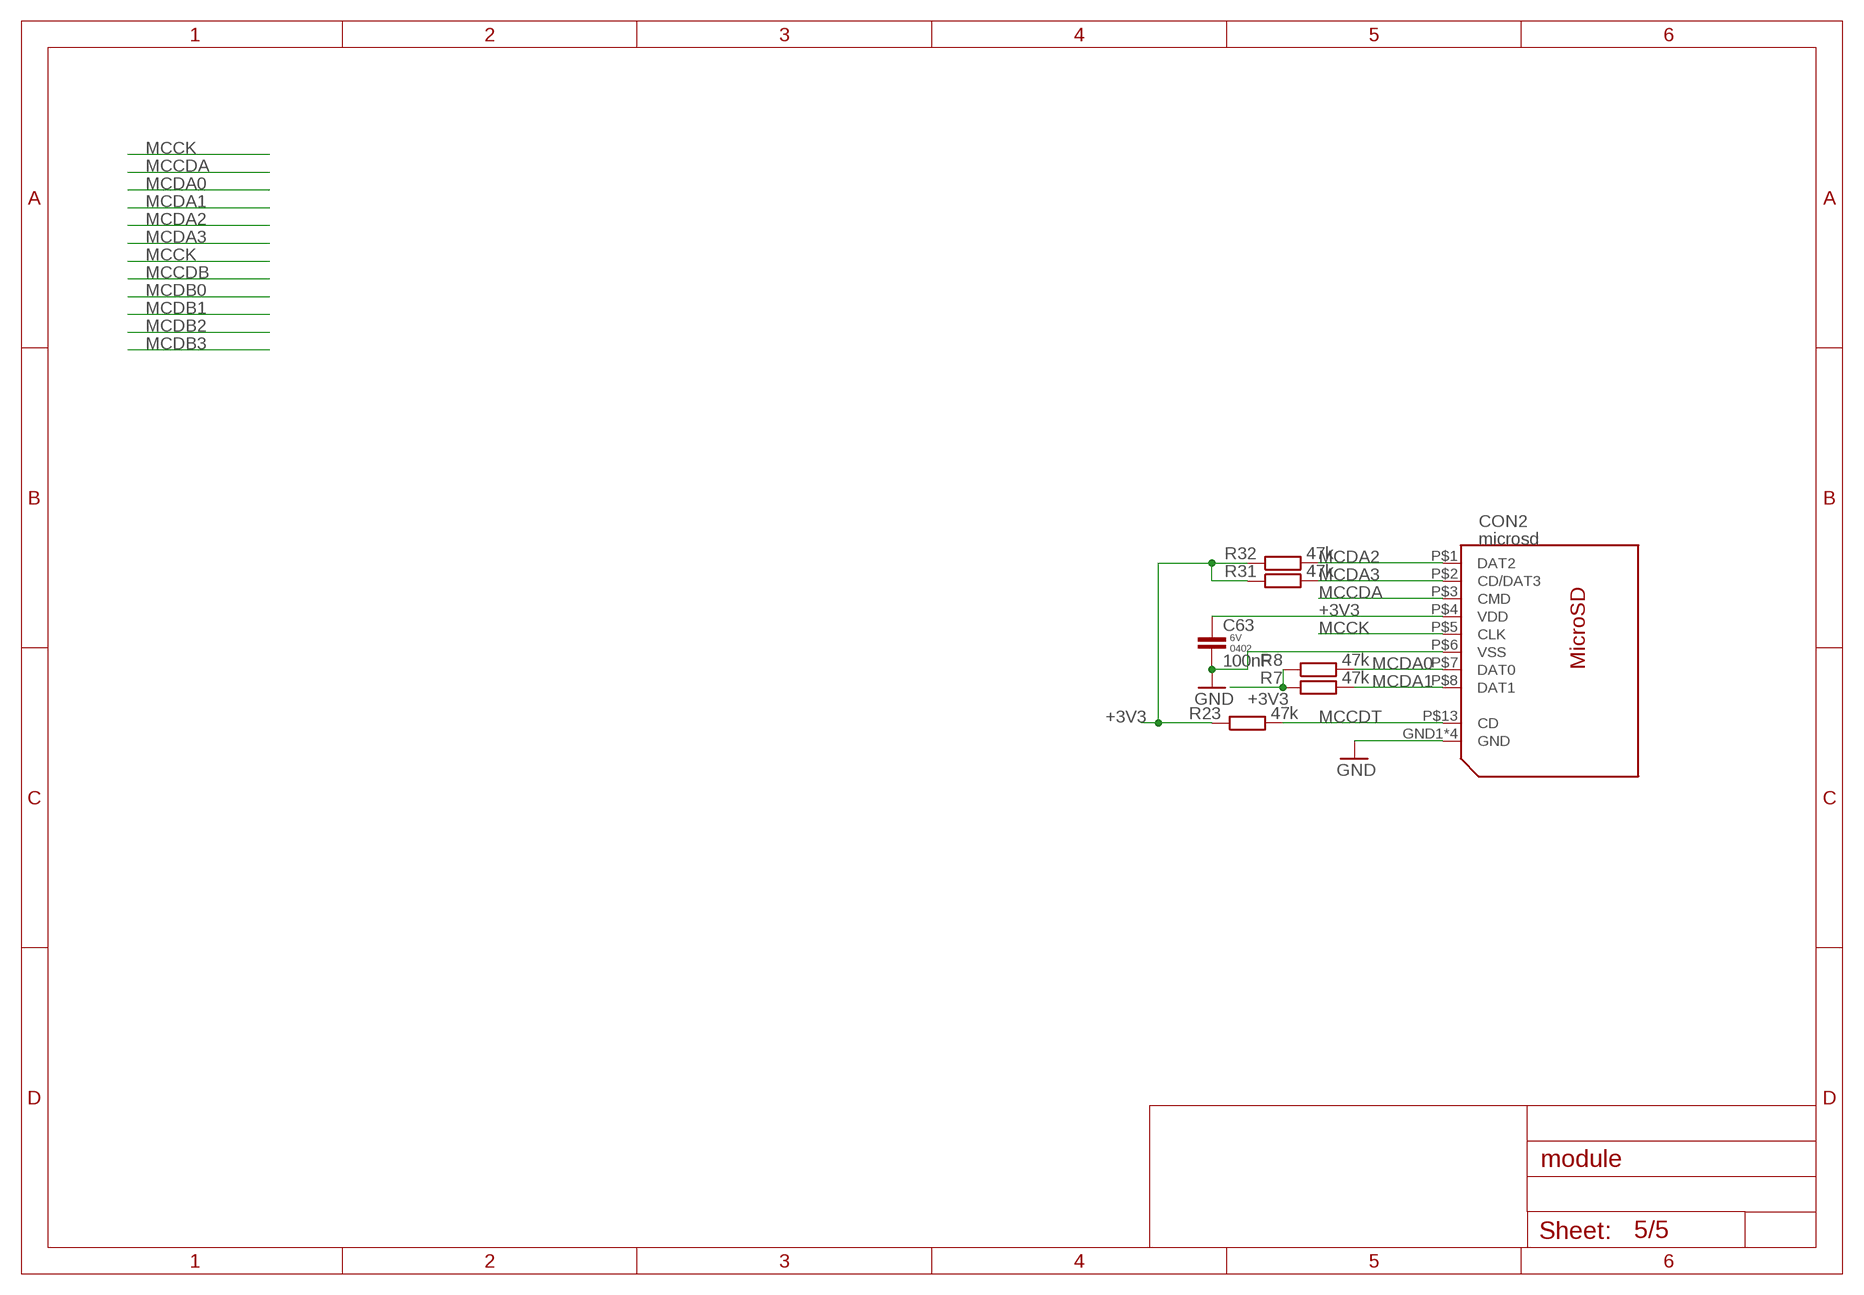
[diagram p4: schematic, sheet 5]

### Parts
C63  100nF  CAP-0402  [C0402K]
CON2  microsd  112J-TXAR  [112J]
R7  47k  R-EU_R0402  [R0402]
R8  47k  R-EU_R0402  [R0402]
R23  47k  R-EU_R0402  [R0402]
R31  47k  R-EU_R0402  [R0402]
R32  47k  R-EU_R0402  [R0402]

### Nets
+3V3: C63.1 CON2.P$4(VDD) R7.1 R8.1 R23.1 R31.1 R32.1 ; also sheet 1,2
GND: C63.2 CON2.GND1(GND) CON2.GND2(GND) CON2.GND3(GND) CON2.GND4(GND) CON2.P$6(VSS) ; also sheet 1,2,3,4
MCCDA: CON2.P$3(CMD) ; also sheet 2
MCCDT: CON2.P$13(CD) R23.2 ; also sheet 2
MCCK: CON2.P$5(CLK) ; also sheet 2
MCDA0: CON2.P$7(DAT0) R8.2 ; also sheet 2
MCDA1: CON2.P$8(DAT1) R7.2 ; also sheet 2
MCDA2: CON2.P$1(DAT2) R32.2 ; also sheet 2
MCDA3: CON2.P$2(CD/DAT3) R31.2 ; also sheet 2

## Library data of the parts
!RST !WKUP +1V1 +1V8 +3V3 +3V3@99 GND GND15 GND99 RECV TP3 TP5 = testpad:PTR1: TEST PIN
C1-C18 C20-C22 C25-C42 C48 C49 C51 C52 C56 C57 C63 = parts-passives:CAP-; PACKAGE: 0402; RATING: 6V
C43 C45-C47 C53-C55 C58-C62 = parts-passives:CAP-; PACKAGE: 0603; RATING: 10V
CON1 = parts-amphenol:10118194-00
CON2 = parts-attend:112J-TXAR
F1 = parts-passives:FUSE-PTC-; CURRENT: 0.6A; PACKAGE: 0603
IC1 IC2 = parts-alliance_mem:MT48LC16M16A2: 256Mb: x16 SDRAM MT48LC16M16A2 - 4 Meg x 16 x 4 banks Source: http://download.micron.com/pdf/datasheets/dram/sdram/256MSDRAM.pdf; OC_FARNELL: unknown; OC_NEWARK: unknown
IC4 = parts-ti:TPS211
IC5 IC7 = parts-diodes:AP65211
IC6 = parts-adesto:AT45DB
J1 J2 = parts-helpers:JUMP-
L1 L2 = parts-ferrocore:DJNR3015; CURRENT: 400mA; PACKAGE: 3015
L3 = parts-passives:IND-; CURRENT: 10mA; PACKAGE: 0402
LED1 = parts-optosupply:OSTB1204
Q1 = parts-srpassives:3215: SMD Crystal 3.2x2.5
Q2 = parts-iqd:CFPX–217: 32.768
R1-R13 R15-R32 R35-R38 = rcl:R-EU_: RESISTOR, European symbol; SPICEPREFIX: R
SV1 = parts-passives:MA18-2: PIN HEADER; OC_FARNELL: unknown; OC_NEWARK: unknown
U1 = parts-microchip:AT91SAM9260-
U$1-U$3 = adafruit:FIDUCIAL: For use by pick and place machines to calibrate the vision/machine, 1mm By microbuilder.eu
USB = parts-passives:MA05-1: PIN HEADER; OC_FARNELL: unknown; OC_NEWARK: unknown
X1 X2 = conn-1.27:CONN-1.27-02X04: .050 DIP EDGE CARD CONNECTOR .050 [1.27mm] CONTACT CENTERS .610" INSULATEOR HEIGHT Source: .050 DIP EDGE CARD.pdf